# EAGLE schematic main (EAGLE 9.2.2)
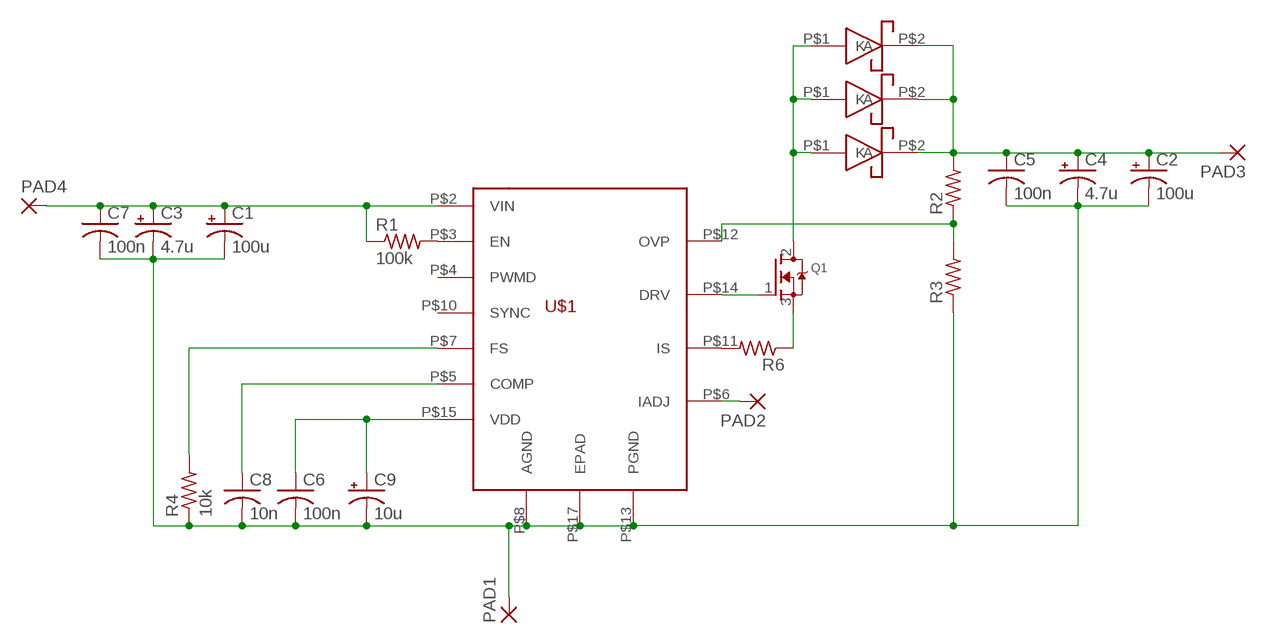
[diagram p0: schematic, sheet 1]

## Parts
C1  100u  CPOL-USE2-5  [E2-5]
C2  100u  CPOL-USE2-5  [E2-5]
C3  4.7u  CPOL-USE2-5  [E2-5]
C4  4.7u  CPOL-USE2-5  [E2-5]
C5  100n  C-US050-030X075  [C050-030X075]
C6  100n  C-US050-030X075  [C050-030X075]
C7  100n  C-US050-030X075  [C050-030X075]
C8  10n  C-USC0603  [C0603]
C9  10u  CPOL-USE2-5  [E2-5]
D1  SS34  [DO-214AB]
D2  SS34  [DO-214AB]
D3  SS34  [DO-214AB]
PAD1  2,54/1,0  [2,54/1,0]
PAD2  2,54/1,0  [2,54/1,0]
PAD3  2,54/1,0  [2,54/1,0]
PAD4  2,54/1,0  [2,54/1,0]
Q1  MOSFET-NGDS_TO220V  [TO220V]
R1  100k  R-US_R0603  [R0603]
R2  R-US_R0603  [R0603]
R3  R-US_R0603  [R0603]
R4  10k  R-US_R0603  [R0603]
R6  R-US_R0603  [R0603]
U$1  MIC3232  [TSSOP16_EPAD]

## Nets
N$1: R1.2 U$1.P$3(EN)
N$2: C1.+ C3.+ C7.1 PAD4.1(P) R1.1 U$1.P$2(VIN)
N$3: C2.+ C4.+ C5.1 D1.P$2(K) D2.P$2(K) D3.P$2(K) PAD3.1(P) R2.2
N$4: R2.1 R3.2 U$1.P$12(OVP)
N$5: C1.- C2.- C3.- C4.- C5.2 C6.2 C7.2 C8.2 C9.- PAD1.1(P) R3.1 R4.1 U$1.P$8(AGND) U$1.P$13(PGND) U$1.P$17(EPAD)
N$6: C8.1 U$1.P$5(COMP)
N$7: C6.1 C9.+ U$1.P$15(VDD)
N$8: R4.2 U$1.P$7(FS)
N$10: PAD2.1(P) U$1.P$6(IADJ)
N$11: R6.2 U$1.P$11(IS)
N$12: Q1.1(G) U$1.P$14(DRV)
N$13: Q1.3(S) R6.1
N$14: D1.P$1(A) D2.P$1(A) D3.P$1(A) Q1.2(D)
Unconnected: U$1.P$4(PWMD) U$1.P$10(SYNC)

## Library data of the parts
C1-C4 C9 = rcl:CPOL-US: POLARIZED CAPACITOR, American symbol; SPICEPREFIX: C
C5-C8 = rcl:C-US: CAPACITOR, American symbol; SPICEPREFIX: C
D1-D3 = 7_segment_lib:SS34
PAD1-PAD4 = 7_segment_lib:2,54/1,0: THROUGH-HOLE PAD
Q1 = adafruit:MOSFET-N: N-Channel Mosfet 2N7002E - 60V 260mA SOT23 [Digikey: 2N7002ET1GOSTR-ND] - REEL BSH103 - 30V 850mA SOT23 [Digikey: 568-5013-1-ND]
R1-R4 R6 = resistor:R-US_: RESISTOR, American symbol
U$1 = 7_segment_lib:MIC3232